# Altium schematic sheet Batteries.SchDoc
size A
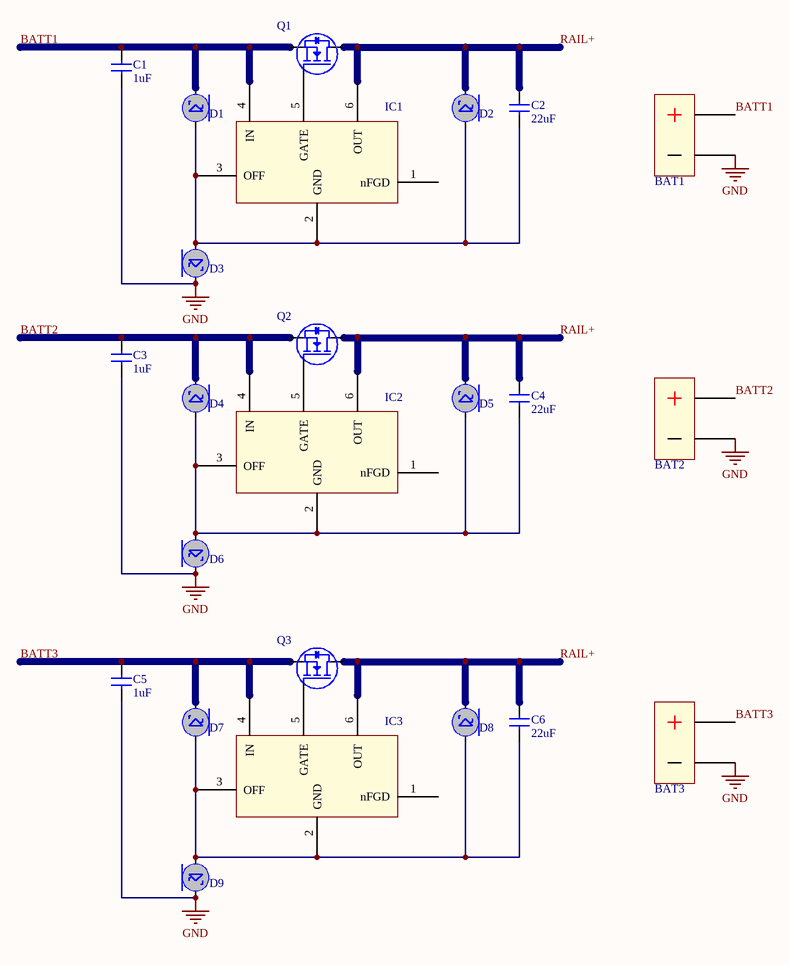
[diagram p0: Batteries.SchDoc]

## Parts
BAT1  BATWIRE  [BATWIRE12]  (value not drawn)
BAT2  BATWIRE  [BATWIRE12]  (value not drawn)
BAT3  BATWIRE  [BATWIRE12]  (value not drawn)
C1  value 1uF  [CAPC0603]  (hidden comment: Cap)
C2  value 22uF  [CAPC0603]  (hidden comment: Cap)
C3  value 1uF  [CAPC0603]  (hidden comment: Cap)
C4  value 22uF  [CAPC0603]  (hidden comment: Cap)
C5  value 1uF  [CAPC0603]  (hidden comment: Cap)
C6  value 22uF  [CAPC0603]  (hidden comment: Cap)
D1  SS16T3G  [SS16T3G]  (value not drawn)
D2  SMBJ100A-13-F  [SMBJ100A-13-F]  (value not drawn)
D3  SS16T3G  [SS16T3G]  (value not drawn)
D4  SS16T3G  [SS16T3G]  (value not drawn)
D5  SMBJ100A-13-F  [SMBJ100A-13-F]  (value not drawn)
D6  SS16T3G  [SS16T3G]  (value not drawn)
D7  SS16T3G  [SS110-TP]  (value not drawn)
D8  SMBJ100A-13-F  [SMBJ100A-13-F]  (value not drawn)
D9  SS16T3G  [SS110-TP]  (value not drawn)
IC1  LM5050MK-2/NOPB  [LM5050MK-2/NOPB]  (value not drawn)
IC2  LM5050MK-2/NOPB  [LM5050MK-2/NOPB]  (value not drawn)
IC3  LM5050MK-2/NOPB  [LM5050MK-2/NOPB]  (value not drawn)
Q1  TPCA8052-H(TE12LQM  [TPCA8052-H(TE12LQM]  (value not drawn)
Q2  TPCA8052-H(TE12LQM  [TPCA8052-H(TE12LQM]  (value not drawn)
Q3  TPCA8052-H(TE12LQM  [TPCA8052-H(TE12LQM]  (value not drawn)

## Nets
GND: BAT1.- BAT2.- BAT3.- C1.2(B) C3.2(B) C5.2(B) D3.C D6.C D9.C
BATT1: BAT1.+ C1.1(A) D1.C IC1.4(IN) Q1.S
BATT2: BAT2.+ C3.1(A) D4.C IC2.4(IN) Q2.S
BATT3: BAT3.+ C5.1(A) D7.C IC3.4(IN) Q3.S
RAIL+: C2.1(A) C4.1(A) C6.1(A) D2.C D5.C D8.C IC1.6(OUT) IC2.6(OUT) IC3.6(OUT) Q1.D Q2.D Q3.D
NetC2_2: C2.2(B) D1.A D2.A D3.A IC1.2(GND) IC1.3(OFF)
NetC4_2: C4.2(B) D4.A D5.A D6.A IC2.2(GND) IC2.3(OFF)
NetC6_2: C6.2(B) D7.A D8.A D9.A IC3.2(GND) IC3.3(OFF)
NetIC1_5: IC1.5(GATE) Q1.G
NetIC2_5: IC2.5(GATE) Q2.G
NetIC3_5: IC3.5(GATE) Q3.G

Not connected (* = marked no-connect by the designer): IC1 1(nFGD); IC2 1(nFGD); IC3 1(nFGD)

## Library data of the parts
BAT1-BAT3 = BATWIRE: Two large gauge leads soldered directly to the board.
D1 D3 D4 D6 D7 D9 = SS16T3G: DIODE SCHOTTKY 60V 1A SMA; Supplier 1: Digi-Key; Supplier Part Number 1: SS110-TPDKR-ND
D2 D5 D8 = SMBJ100A-13-F: TVS DIODE 100VWM 162VC SMB; Supplier 1: Digi-Key; Supplier Part Number 1: SMBJ100A-FDIDKR-ND
IC1-IC3 = LM5050MK-2/NOPB: IC OR CTRLR N+1 6SOT; Supplier 1: Digi-Key; Supplier Part Number 1: LM5050MK-2/NOPBDKR-ND
Q1-Q3 = TPCA8052-H: MOSFET N-CH 40V 20A 8SOP; Supplier 1: Digi-Key; Supplier Part Number 1: TPCA8052-H(TE12LQMDKR-ND
C1-C6 = Cap: Supplier 1: Digi-Key; Supplier Part Number 1: 1276-1000-1-ND